# EAGLE schematic BandpassedGainAmp (EAGLE 9.6.2)
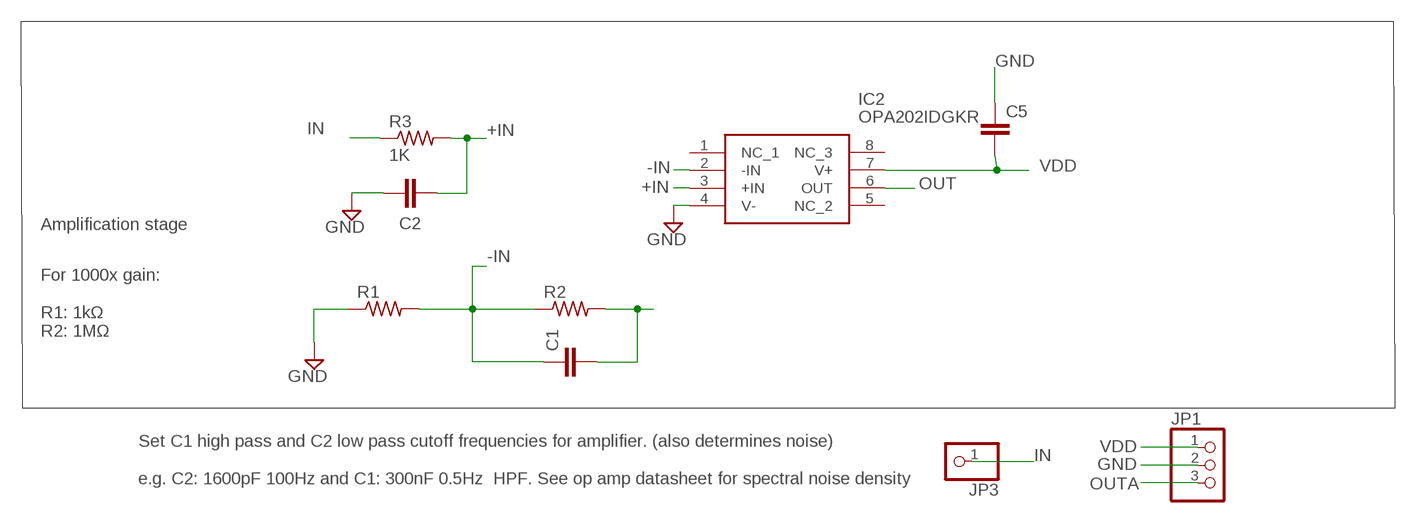
[diagram p0: schematic, sheet 1]

## Parts
C1  C-EUC0402  [C0402]
C2  C-EUC0402  [C0402]
C5  C2.5/2  [C2.5-2]
IC2  OPA202IDGKR  [SOP65P490X110-8N]
JP1  PINHD-1X3  [1X03]
JP3  PINHD-1X1  [1X01]
R1  R-US_0204/5  [0204/5]
R2  R-US_0204/5  [0204/5]
R3  1K  R-US_0204/5  [0204/5]

## Nets
+IN: C2.2 IC2.3(+IN) R3.2
-IN: C1.1 IC2.2(-IN) R1.2 R2.1
GND: C2.1 C5.1 IC2.4(V-) JP1.2 R1.1
IN: JP3.1 R3.1
N$3: C1.2 R2.2
OUT: IC2.6(OUT)
OUTA: JP1.3
VDD: C5.2 IC2.7(V+) JP1.1
Unconnected: IC2.1(NC_1) IC2.5(NC_2) IC2.8(NC_3)

## Notes on the sheet
- Amplification stage
- For 1000x gain:
  
  R1: 1kΩ
  R2: 1MΩ
- Set C1 high pass and C2 low pass cutoff frequencies for amplifier. (also determines noise)
  
  e.g. C2: 1600pF 100Hz and C1: 300nF 0.5Hz  HPF. See op amp datasheet for spectral noise density

## Library data of the parts
C1 C2 = rcl:C-EU: CAPACITOR, European symbol; SPICEPREFIX: C
C5 = capacitor-wima:C: CAPACITOR naming: grid - package width
IC2 = OPA202IDGKR:OPA202IDGKR: Precision Amplifiers Low noise (0.2- uVPP, 9-nV/ Hz), heavy capacitive drive (25-nF), super beta, precision op amp 8-VSSOP -40 to 105 Source: Datasheet <https://www.ti.com/lit/ds/symlink/opa202.pdf?ts=1636402854008&ref_url=https%3A%2F%2Fwww.ti.com%2Fproduct%2FOPA202>; DESCRIPTION: Precision Amplifiers Low noise (0.2- uVPP, 9-nV/ Hz), heavy capacitive drive (25-nF), super beta, precision op amp 8-VSSOP -40 to 105; HEIGHT: 1.1mm; MANUFACTURER_NAME: Texas Instruments; MANUFACTURER_PART_NUMBER: OPA202IDGKR; MOUSER_PART_NUMBER: 595-OPA202IDGKR; MOUSER_PRICE-STOCK: https://www.mouser.co.uk/ProductDetail/Texas-Instruments/OPA202IDGKR?qs=7MVldsJ5UaxKAkmdzK%2FGCA%3D%3D
JP1 = pinhead:PINHD-1X3: PIN HEADER
JP3 = pinhead:PINHD-1X1: PIN HEADER
R1-R3 = rcl:R-US_: RESISTOR, American symbol; SPICEPREFIX: R